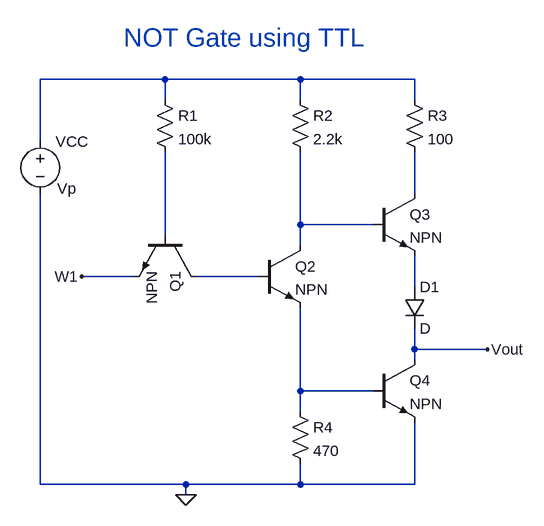
[diagram p0: schematic Draft40.asc]
Draft40.asc, the LTspice schematic file:
Version 4
SHEET 1 880 740
WIRE 144 80 -48 80
WIRE 352 80 144 80
WIRE 528 80 352 80
WIRE 144 112 144 80
WIRE 352 112 352 80
WIRE 528 112 528 80
WIRE -48 176 -48 80
WIRE 528 256 528 192
WIRE 352 304 352 192
WIRE 464 304 352 304
WIRE 144 320 144 192
WIRE 352 336 352 304
WIRE 96 384 16 384
WIRE 288 384 192 384
WIRE 528 400 528 352
WIRE 528 496 528 464
WIRE 640 496 528 496
WIRE 528 512 528 496
WIRE 352 560 352 432
WIRE 464 560 352 560
WIRE 352 592 352 560
WIRE -48 704 -48 256
WIRE 176 704 -48 704
WIRE 352 704 352 672
WIRE 352 704 176 704
WIRE 528 704 528 608
WIRE 528 704 352 704
WIRE 176 720 176 704
FLAG 16 384 W1
FLAG 640 496 Vout
FLAG 176 720 0
SYMBOL res 128 96 R0
SYMATTR InstName R1
SYMATTR Value 100k
SYMBOL res 336 96 R0
SYMATTR InstName R2
SYMATTR Value 2.2k
SYMBOL res 512 96 R0
SYMATTR InstName R3
SYMATTR Value 100
SYMBOL npn 192 320 R90
SYMATTR InstName Q1
SYMBOL npn 288 336 R0
SYMATTR InstName Q2
SYMBOL npn 464 256 R0
SYMATTR InstName Q3
SYMBOL npn 464 512 R0
SYMATTR InstName Q4
SYMBOL diode 512 400 R0
SYMATTR InstName D1
SYMBOL res 336 576 R0
SYMATTR InstName R4
SYMATTR Value 470
SYMBOL voltage -48 160 R0
WINDOW 3 26 88 Left 2
WINDOW 123 0 0 Left 0
WINDOW 39 0 0 Left 0
SYMATTR InstName VCC
SYMATTR Value Vp
TEXT 80 16 Left 4 ;NOT Gate using TTL

The netlist it stands for:
* Draft40.asc
R1 N001 N004 100k
R2 N001 N003 2.2k
R3 N001 N002 100
Q1 N005 N004 W1 0 NPN
Q2 N003 N005 N007 0 NPN
Q3 N002 N003 N006 0 NPN
Q4 Vout N007 0 0 NPN
D1 N006 Vout D
R4 N007 0 470
VCC N001 0 Vp
.model D D
.lib standard.dio
.model NPN NPN
.model PNP PNP
.lib standard.bjt
* NOT Gate using TTL
.backanno
.end